# Altium project Bluetooth_Controlled_Led_Matrix_Design.PrjPcb
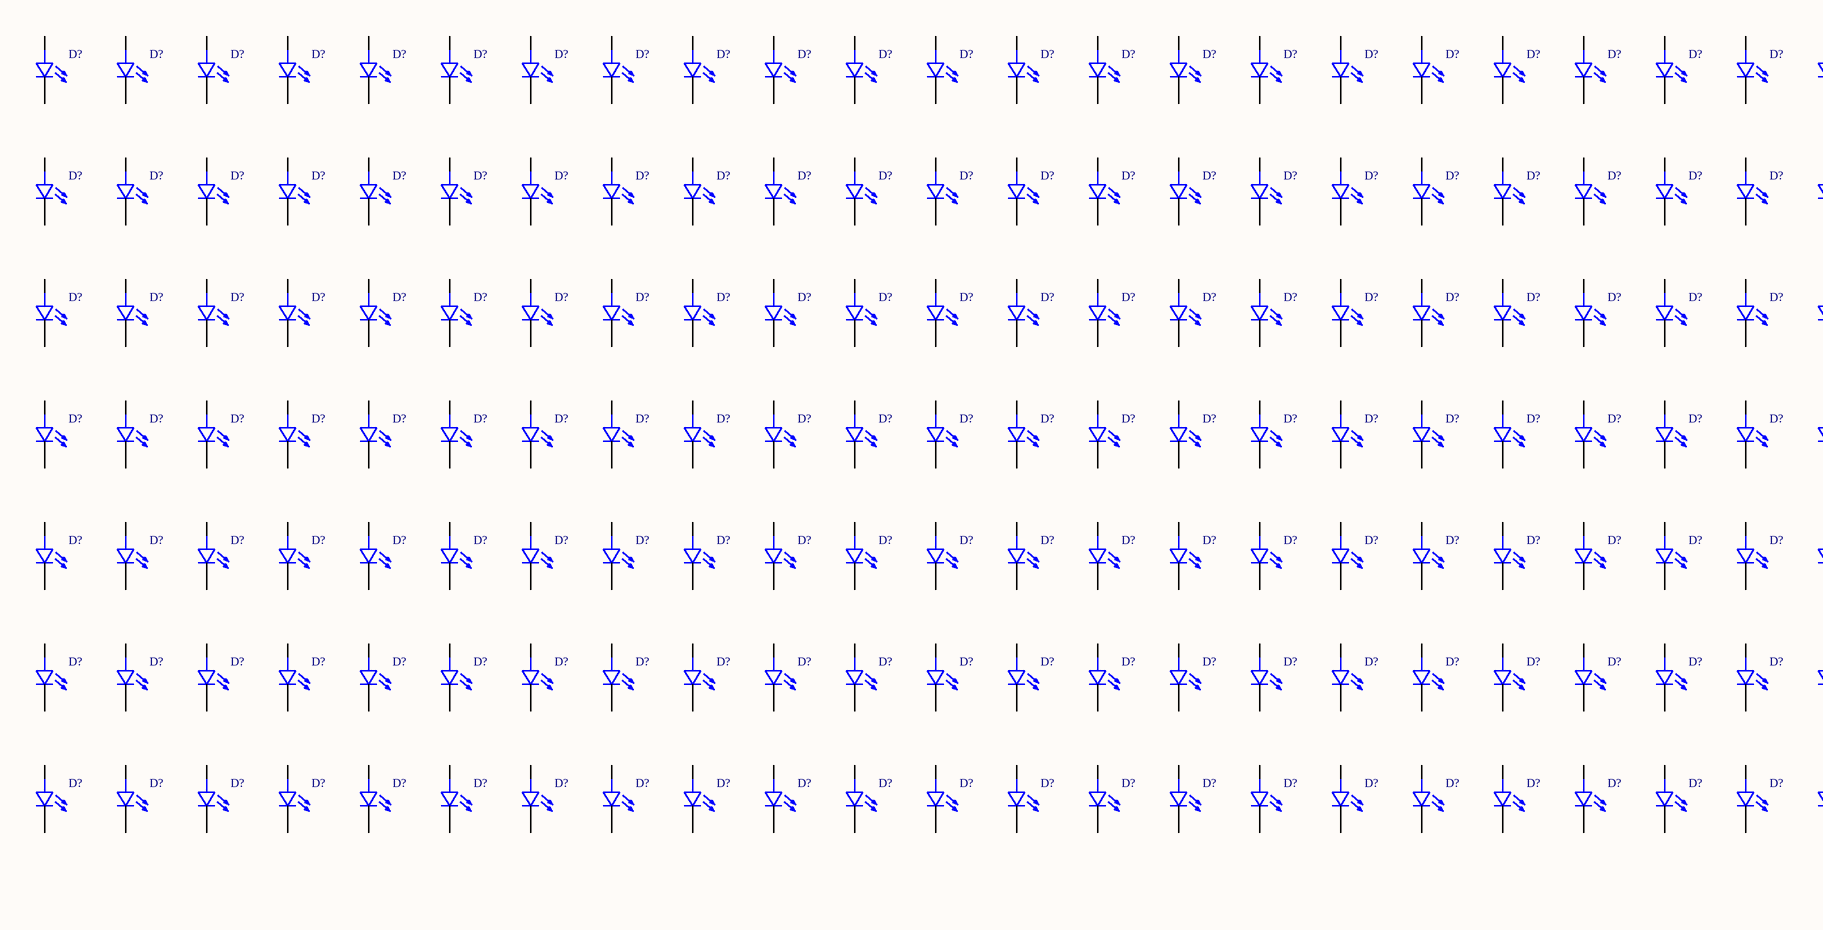
[diagram p0: 7x24_Led_Matrix_Design.SchDoc, left]
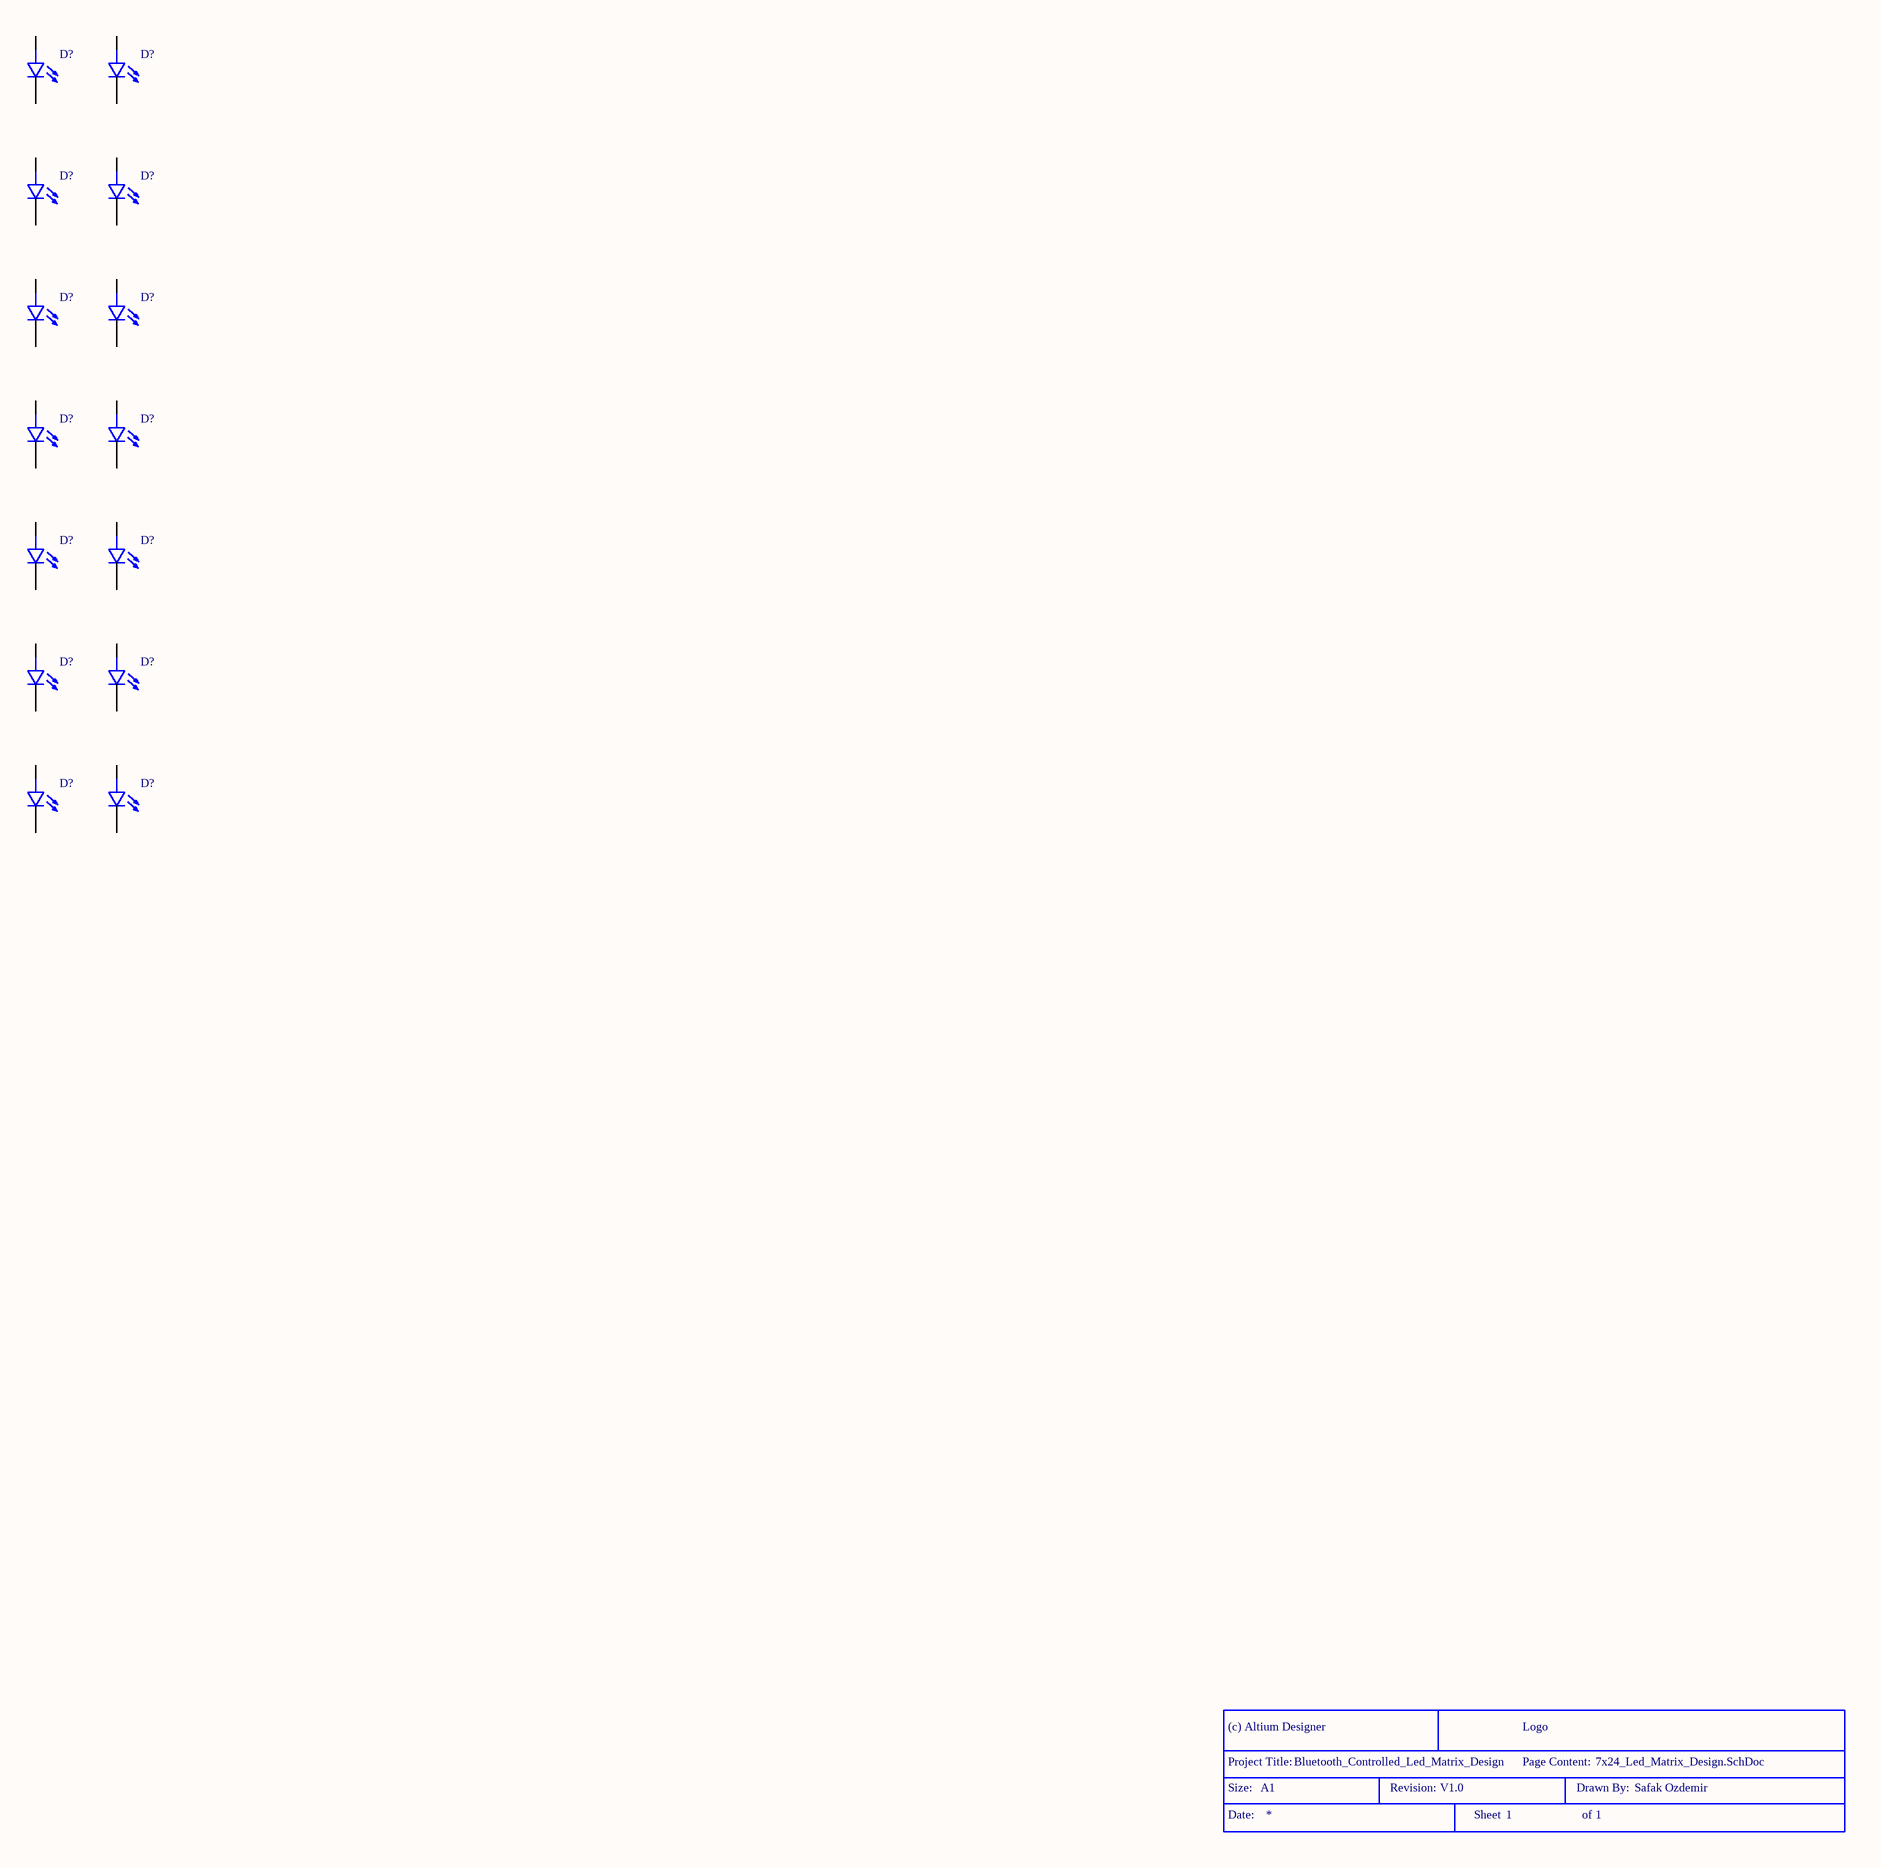
[diagram p1: 7x24_Led_Matrix_Design.SchDoc, right]
NameProject: Bluetooth_Controlled_Led_Matrix_Design
1 sheet, 169 parts. Net scope: global (net labels, ports and power ports of the same name join across sheets).
Board file: Bluetooth_Controlled_Led_Matrix_Design.PcbDoc

## Sheet 7x24_Led_Matrix_Design.SchDoc
size A1; DrawnBy: Safak Ozdemir; Revision: V1.0; SheetNumber: 1; SheetTotal: 1

### Parts
(Parts that share a designator on the sheet are numbered #1, #2 ... from top to bottom, then left to right.)
*  Size: A1  Drawn By: Safak Ozdemir  (hidden comment: Title Block)  (graphical)
D?#1  OF-SMD3528WC  [LED_OF-SMD3528WC]  (value not drawn)
D?#2  OF-SMD3528WC  [LED_OF-SMD3528WC]  (value not drawn)
D?#3  OF-SMD3528WC  [LED_OF-SMD3528WC]  (value not drawn)
D?#4  OF-SMD3528WC  [LED_OF-SMD3528WC]  (value not drawn)
D?#5  OF-SMD3528WC  [LED_OF-SMD3528WC]  (value not drawn)
D?#6  OF-SMD3528WC  [LED_OF-SMD3528WC]  (value not drawn)
D?#7  OF-SMD3528WC  [LED_OF-SMD3528WC]  (value not drawn)
D?#8  OF-SMD3528WC  [LED_OF-SMD3528WC]  (value not drawn)
D?#9  OF-SMD3528WC  [LED_OF-SMD3528WC]  (value not drawn)
D?#10  OF-SMD3528WC  [LED_OF-SMD3528WC]  (value not drawn)
D?#11  OF-SMD3528WC  [LED_OF-SMD3528WC]  (value not drawn)
D?#12  OF-SMD3528WC  [LED_OF-SMD3528WC]  (value not drawn)
D?#13  OF-SMD3528WC  [LED_OF-SMD3528WC]  (value not drawn)
D?#14  OF-SMD3528WC  [LED_OF-SMD3528WC]  (value not drawn)
D?#15  OF-SMD3528WC  [LED_OF-SMD3528WC]  (value not drawn)
D?#16  OF-SMD3528WC  [LED_OF-SMD3528WC]  (value not drawn)
D?#17  OF-SMD3528WC  [LED_OF-SMD3528WC]  (value not drawn)
D?#18  OF-SMD3528WC  [LED_OF-SMD3528WC]  (value not drawn)
D?#19  OF-SMD3528WC  [LED_OF-SMD3528WC]  (value not drawn)
D?#20  OF-SMD3528WC  [LED_OF-SMD3528WC]  (value not drawn)
D?#21  OF-SMD3528WC  [LED_OF-SMD3528WC]  (value not drawn)
D?#22  OF-SMD3528WC  [LED_OF-SMD3528WC]  (value not drawn)
D?#23  OF-SMD3528WC  [LED_OF-SMD3528WC]  (value not drawn)
D?#24  OF-SMD3528WC  [LED_OF-SMD3528WC]  (value not drawn)
D?#25  OF-SMD3528WC  [LED_OF-SMD3528WC]  (value not drawn)
D?#26  OF-SMD3528WC  [LED_OF-SMD3528WC]  (value not drawn)
D?#27  OF-SMD3528WC  [LED_OF-SMD3528WC]  (value not drawn)
D?#28  OF-SMD3528WC  [LED_OF-SMD3528WC]  (value not drawn)
D?#29  OF-SMD3528WC  [LED_OF-SMD3528WC]  (value not drawn)
D?#30  OF-SMD3528WC  [LED_OF-SMD3528WC]  (value not drawn)
D?#31  OF-SMD3528WC  [LED_OF-SMD3528WC]  (value not drawn)
D?#32  OF-SMD3528WC  [LED_OF-SMD3528WC]  (value not drawn)
D?#33  OF-SMD3528WC  [LED_OF-SMD3528WC]  (value not drawn)
D?#34  OF-SMD3528WC  [LED_OF-SMD3528WC]  (value not drawn)
D?#35  OF-SMD3528WC  [LED_OF-SMD3528WC]  (value not drawn)
D?#36  OF-SMD3528WC  [LED_OF-SMD3528WC]  (value not drawn)
D?#37  OF-SMD3528WC  [LED_OF-SMD3528WC]  (value not drawn)
D?#38  OF-SMD3528WC  [LED_OF-SMD3528WC]  (value not drawn)
D?#39  OF-SMD3528WC  [LED_OF-SMD3528WC]  (value not drawn)
D?#40  OF-SMD3528WC  [LED_OF-SMD3528WC]  (value not drawn)
D?#41  OF-SMD3528WC  [LED_OF-SMD3528WC]  (value not drawn)
D?#42  OF-SMD3528WC  [LED_OF-SMD3528WC]  (value not drawn)
D?#43  OF-SMD3528WC  [LED_OF-SMD3528WC]  (value not drawn)
D?#44  OF-SMD3528WC  [LED_OF-SMD3528WC]  (value not drawn)
D?#45  OF-SMD3528WC  [LED_OF-SMD3528WC]  (value not drawn)
D?#46  OF-SMD3528WC  [LED_OF-SMD3528WC]  (value not drawn)
D?#47  OF-SMD3528WC  [LED_OF-SMD3528WC]  (value not drawn)
D?#48  OF-SMD3528WC  [LED_OF-SMD3528WC]  (value not drawn)
D?#49  OF-SMD3528WC  [LED_OF-SMD3528WC]  (value not drawn)
D?#50  OF-SMD3528WC  [LED_OF-SMD3528WC]  (value not drawn)
D?#51  OF-SMD3528WC  [LED_OF-SMD3528WC]  (value not drawn)
D?#52  OF-SMD3528WC  [LED_OF-SMD3528WC]  (value not drawn)
D?#53  OF-SMD3528WC  [LED_OF-SMD3528WC]  (value not drawn)
D?#54  OF-SMD3528WC  [LED_OF-SMD3528WC]  (value not drawn)
D?#55  OF-SMD3528WC  [LED_OF-SMD3528WC]  (value not drawn)
D?#56  OF-SMD3528WC  [LED_OF-SMD3528WC]  (value not drawn)
D?#57  OF-SMD3528WC  [LED_OF-SMD3528WC]  (value not drawn)
D?#58  OF-SMD3528WC  [LED_OF-SMD3528WC]  (value not drawn)
D?#59  OF-SMD3528WC  [LED_OF-SMD3528WC]  (value not drawn)
D?#60  OF-SMD3528WC  [LED_OF-SMD3528WC]  (value not drawn)
D?#61  OF-SMD3528WC  [LED_OF-SMD3528WC]  (value not drawn)
D?#62  OF-SMD3528WC  [LED_OF-SMD3528WC]  (value not drawn)
D?#63  OF-SMD3528WC  [LED_OF-SMD3528WC]  (value not drawn)
D?#64  OF-SMD3528WC  [LED_OF-SMD3528WC]  (value not drawn)
D?#65  OF-SMD3528WC  [LED_OF-SMD3528WC]  (value not drawn)
D?#66  OF-SMD3528WC  [LED_OF-SMD3528WC]  (value not drawn)
D?#67  OF-SMD3528WC  [LED_OF-SMD3528WC]  (value not drawn)
D?#68  OF-SMD3528WC  [LED_OF-SMD3528WC]  (value not drawn)
D?#69  OF-SMD3528WC  [LED_OF-SMD3528WC]  (value not drawn)
D?#70  OF-SMD3528WC  [LED_OF-SMD3528WC]  (value not drawn)
D?#71  OF-SMD3528WC  [LED_OF-SMD3528WC]  (value not drawn)
D?#72  OF-SMD3528WC  [LED_OF-SMD3528WC]  (value not drawn)
D?#73  OF-SMD3528WC  [LED_OF-SMD3528WC]  (value not drawn)
D?#74  OF-SMD3528WC  [LED_OF-SMD3528WC]  (value not drawn)
D?#75  OF-SMD3528WC  [LED_OF-SMD3528WC]  (value not drawn)
D?#76  OF-SMD3528WC  [LED_OF-SMD3528WC]  (value not drawn)
D?#77  OF-SMD3528WC  [LED_OF-SMD3528WC]  (value not drawn)
D?#78  OF-SMD3528WC  [LED_OF-SMD3528WC]  (value not drawn)
D?#79  OF-SMD3528WC  [LED_OF-SMD3528WC]  (value not drawn)
D?#80  OF-SMD3528WC  [LED_OF-SMD3528WC]  (value not drawn)
D?#81  OF-SMD3528WC  [LED_OF-SMD3528WC]  (value not drawn)
D?#82  OF-SMD3528WC  [LED_OF-SMD3528WC]  (value not drawn)
D?#83  OF-SMD3528WC  [LED_OF-SMD3528WC]  (value not drawn)
D?#84  OF-SMD3528WC  [LED_OF-SMD3528WC]  (value not drawn)
D?#85  OF-SMD3528WC  [LED_OF-SMD3528WC]  (value not drawn)
D?#86  OF-SMD3528WC  [LED_OF-SMD3528WC]  (value not drawn)
D?#87  OF-SMD3528WC  [LED_OF-SMD3528WC]  (value not drawn)
D?#88  OF-SMD3528WC  [LED_OF-SMD3528WC]  (value not drawn)
D?#89  OF-SMD3528WC  [LED_OF-SMD3528WC]  (value not drawn)
D?#90  OF-SMD3528WC  [LED_OF-SMD3528WC]  (value not drawn)
D?#91  OF-SMD3528WC  [LED_OF-SMD3528WC]  (value not drawn)
D?#92  OF-SMD3528WC  [LED_OF-SMD3528WC]  (value not drawn)
D?#93  OF-SMD3528WC  [LED_OF-SMD3528WC]  (value not drawn)
D?#94  OF-SMD3528WC  [LED_OF-SMD3528WC]  (value not drawn)
D?#95  OF-SMD3528WC  [LED_OF-SMD3528WC]  (value not drawn)
D?#96  OF-SMD3528WC  [LED_OF-SMD3528WC]  (value not drawn)
D?#97  OF-SMD3528WC  [LED_OF-SMD3528WC]  (value not drawn)
D?#98  OF-SMD3528WC  [LED_OF-SMD3528WC]  (value not drawn)
D?#99  OF-SMD3528WC  [LED_OF-SMD3528WC]  (value not drawn)
D?#100  OF-SMD3528WC  [LED_OF-SMD3528WC]  (value not drawn)
D?#101  OF-SMD3528WC  [LED_OF-SMD3528WC]  (value not drawn)
D?#102  OF-SMD3528WC  [LED_OF-SMD3528WC]  (value not drawn)
D?#103  OF-SMD3528WC  [LED_OF-SMD3528WC]  (value not drawn)
D?#104  OF-SMD3528WC  [LED_OF-SMD3528WC]  (value not drawn)
D?#105  OF-SMD3528WC  [LED_OF-SMD3528WC]  (value not drawn)
D?#106  OF-SMD3528WC  [LED_OF-SMD3528WC]  (value not drawn)
D?#107  OF-SMD3528WC  [LED_OF-SMD3528WC]  (value not drawn)
D?#108  OF-SMD3528WC  [LED_OF-SMD3528WC]  (value not drawn)
D?#109  OF-SMD3528WC  [LED_OF-SMD3528WC]  (value not drawn)
D?#110  OF-SMD3528WC  [LED_OF-SMD3528WC]  (value not drawn)
D?#111  OF-SMD3528WC  [LED_OF-SMD3528WC]  (value not drawn)
D?#112  OF-SMD3528WC  [LED_OF-SMD3528WC]  (value not drawn)
D?#113  OF-SMD3528WC  [LED_OF-SMD3528WC]  (value not drawn)
D?#114  OF-SMD3528WC  [LED_OF-SMD3528WC]  (value not drawn)
D?#115  OF-SMD3528WC  [LED_OF-SMD3528WC]  (value not drawn)
D?#116  OF-SMD3528WC  [LED_OF-SMD3528WC]  (value not drawn)
D?#117  OF-SMD3528WC  [LED_OF-SMD3528WC]  (value not drawn)
D?#118  OF-SMD3528WC  [LED_OF-SMD3528WC]  (value not drawn)
D?#119  OF-SMD3528WC  [LED_OF-SMD3528WC]  (value not drawn)
D?#120  OF-SMD3528WC  [LED_OF-SMD3528WC]  (value not drawn)
D?#121  OF-SMD3528WC  [LED_OF-SMD3528WC]  (value not drawn)
D?#122  OF-SMD3528WC  [LED_OF-SMD3528WC]  (value not drawn)
D?#123  OF-SMD3528WC  [LED_OF-SMD3528WC]  (value not drawn)
D?#124  OF-SMD3528WC  [LED_OF-SMD3528WC]  (value not drawn)
D?#125  OF-SMD3528WC  [LED_OF-SMD3528WC]  (value not drawn)
D?#126  OF-SMD3528WC  [LED_OF-SMD3528WC]  (value not drawn)
D?#127  OF-SMD3528WC  [LED_OF-SMD3528WC]  (value not drawn)
D?#128  OF-SMD3528WC  [LED_OF-SMD3528WC]  (value not drawn)
D?#129  OF-SMD3528WC  [LED_OF-SMD3528WC]  (value not drawn)
D?#130  OF-SMD3528WC  [LED_OF-SMD3528WC]  (value not drawn)
D?#131  OF-SMD3528WC  [LED_OF-SMD3528WC]  (value not drawn)
D?#132  OF-SMD3528WC  [LED_OF-SMD3528WC]  (value not drawn)
D?#133  OF-SMD3528WC  [LED_OF-SMD3528WC]  (value not drawn)
D?#134  OF-SMD3528WC  [LED_OF-SMD3528WC]  (value not drawn)
D?#135  OF-SMD3528WC  [LED_OF-SMD3528WC]  (value not drawn)
D?#136  OF-SMD3528WC  [LED_OF-SMD3528WC]  (value not drawn)
D?#137  OF-SMD3528WC  [LED_OF-SMD3528WC]  (value not drawn)
D?#138  OF-SMD3528WC  [LED_OF-SMD3528WC]  (value not drawn)
D?#139  OF-SMD3528WC  [LED_OF-SMD3528WC]  (value not drawn)
D?#140  OF-SMD3528WC  [LED_OF-SMD3528WC]  (value not drawn)
D?#141  OF-SMD3528WC  [LED_OF-SMD3528WC]  (value not drawn)
D?#142  OF-SMD3528WC  [LED_OF-SMD3528WC]  (value not drawn)
D?#143  OF-SMD3528WC  [LED_OF-SMD3528WC]  (value not drawn)
D?#144  OF-SMD3528WC  [LED_OF-SMD3528WC]  (value not drawn)
D?#145  OF-SMD3528WC  [LED_OF-SMD3528WC]  (value not drawn)
D?#146  OF-SMD3528WC  [LED_OF-SMD3528WC]  (value not drawn)
D?#147  OF-SMD3528WC  [LED_OF-SMD3528WC]  (value not drawn)
D?#148  OF-SMD3528WC  [LED_OF-SMD3528WC]  (value not drawn)
D?#149  OF-SMD3528WC  [LED_OF-SMD3528WC]  (value not drawn)
D?#150  OF-SMD3528WC  [LED_OF-SMD3528WC]  (value not drawn)
D?#151  OF-SMD3528WC  [LED_OF-SMD3528WC]  (value not drawn)
D?#152  OF-SMD3528WC  [LED_OF-SMD3528WC]  (value not drawn)
D?#153  OF-SMD3528WC  [LED_OF-SMD3528WC]  (value not drawn)
D?#154  OF-SMD3528WC  [LED_OF-SMD3528WC]  (value not drawn)
D?#155  OF-SMD3528WC  [LED_OF-SMD3528WC]  (value not drawn)
D?#156  OF-SMD3528WC  [LED_OF-SMD3528WC]  (value not drawn)
D?#157  OF-SMD3528WC  [LED_OF-SMD3528WC]  (value not drawn)
D?#158  OF-SMD3528WC  [LED_OF-SMD3528WC]  (value not drawn)
D?#159  OF-SMD3528WC  [LED_OF-SMD3528WC]  (value not drawn)
D?#160  OF-SMD3528WC  [LED_OF-SMD3528WC]  (value not drawn)
D?#161  OF-SMD3528WC  [LED_OF-SMD3528WC]  (value not drawn)
D?#162  OF-SMD3528WC  [LED_OF-SMD3528WC]  (value not drawn)
D?#163  OF-SMD3528WC  [LED_OF-SMD3528WC]  (value not drawn)
D?#164  OF-SMD3528WC  [LED_OF-SMD3528WC]  (value not drawn)
D?#165  OF-SMD3528WC  [LED_OF-SMD3528WC]  (value not drawn)
D?#166  OF-SMD3528WC  [LED_OF-SMD3528WC]  (value not drawn)
D?#167  OF-SMD3528WC  [LED_OF-SMD3528WC]  (value not drawn)
D?#168  OF-SMD3528WC  [LED_OF-SMD3528WC]  (value not drawn)

### Nets

Not connected (* = marked no-connect by the designer): D?#1 1(A) 2(C); D?#2 1(A) 2(C); D?#3 1(A) 2(C); D?#4 1(A) 2(C); D?#5 1(A) 2(C); D?#6 1(A) 2(C); D?#7 1(A) 2(C); D?#8 1(A) 2(C); D?#9 1(A) 2(C); D?#10 1(A) 2(C); D?#11 1(A) 2(C); D?#12 1(A) 2(C); D?#13 1(A) 2(C); D?#14 1(A) 2(C); D?#15 1(A) 2(C); D?#16 1(A) 2(C); D?#17 1(A) 2(C); D?#18 1(A) 2(C); D?#19 1(A) 2(C); D?#20 1(A) 2(C); D?#21 1(A) 2(C); D?#22 1(A) 2(C); D?#23 1(A) 2(C); D?#24 1(A) 2(C); D?#25 1(A) 2(C); D?#26 1(A) 2(C); D?#27 1(A) 2(C); D?#28 1(A) 2(C); D?#29 1(A) 2(C); D?#30 1(A) 2(C); D?#31 1(A) 2(C); D?#32 1(A) 2(C); D?#33 1(A) 2(C); D?#34 1(A) 2(C); D?#35 1(A) 2(C); D?#36 1(A) 2(C); D?#37 1(A) 2(C); D?#38 1(A) 2(C); D?#39 1(A) 2(C); D?#40 1(A) 2(C); D?#41 1(A) 2(C); D?#42 1(A) 2(C); D?#43 1(A) 2(C); D?#44 1(A) 2(C); D?#45 1(A) 2(C); D?#46 1(A) 2(C); D?#47 1(A) 2(C); D?#48 1(A) 2(C); D?#49 1(A) 2(C); D?#50 1(A) 2(C); D?#51 1(A) 2(C); D?#52 1(A) 2(C); D?#53 1(A) 2(C); D?#54 1(A) 2(C); D?#55 1(A) 2(C); D?#56 1(A) 2(C); D?#57 1(A) 2(C); D?#58 1(A) 2(C); D?#59 1(A) 2(C); D?#60 1(A) 2(C); D?#61 1(A) 2(C); D?#62 1(A) 2(C); D?#63 1(A) 2(C); D?#64 1(A) 2(C); D?#65 1(A) 2(C); D?#66 1(A) 2(C); D?#67 1(A) 2(C); D?#68 1(A) 2(C); D?#69 1(A) 2(C); D?#70 1(A) 2(C); D?#71 1(A) 2(C); D?#72 1(A) 2(C); D?#73 1(A) 2(C); D?#74 1(A) 2(C); D?#75 1(A) 2(C); D?#76 1(A) 2(C); D?#77 1(A) 2(C); D?#78 1(A) 2(C); D?#79 1(A) 2(C); D?#80 1(A) 2(C); D?#81 1(A) 2(C); D?#82 1(A) 2(C); D?#83 1(A) 2(C); D?#84 1(A) 2(C); D?#85 1(A) 2(C); D?#86 1(A) 2(C); D?#87 1(A) 2(C); D?#88 1(A) 2(C); D?#89 1(A) 2(C); D?#90 1(A) 2(C); D?#91 1(A) 2(C); D?#92 1(A) 2(C); D?#93 1(A) 2(C); D?#94 1(A) 2(C); D?#95 1(A) 2(C); D?#96 1(A) 2(C); D?#97 1(A) 2(C); D?#98 1(A) 2(C); D?#99 1(A) 2(C); D?#100 1(A) 2(C); D?#101 1(A) 2(C); D?#102 1(A) 2(C); D?#103 1(A) 2(C); D?#104 1(A) 2(C); D?#105 1(A) 2(C); D?#106 1(A) 2(C); D?#107 1(A) 2(C); D?#108 1(A) 2(C); D?#109 1(A) 2(C); D?#110 1(A) 2(C); D?#111 1(A) 2(C); D?#112 1(A) 2(C); D?#113 1(A) 2(C); D?#114 1(A) 2(C); D?#115 1(A) 2(C); D?#116 1(A) 2(C); D?#117 1(A) 2(C); D?#118 1(A) 2(C); D?#119 1(A) 2(C); D?#120 1(A) 2(C); D?#121 1(A) 2(C); D?#122 1(A) 2(C); D?#123 1(A) 2(C); D?#124 1(A) 2(C); D?#125 1(A) 2(C); D?#126 1(A) 2(C); D?#127 1(A) 2(C); D?#128 1(A) 2(C); D?#129 1(A) 2(C); D?#130 1(A) 2(C); D?#131 1(A) 2(C); D?#132 1(A) 2(C); D?#133 1(A) 2(C); D?#134 1(A) 2(C); D?#135 1(A) 2(C); D?#136 1(A) 2(C); D?#137 1(A) 2(C); D?#138 1(A) 2(C); D?#139 1(A) 2(C); D?#140 1(A) 2(C); D?#141 1(A) 2(C); D?#142 1(A) 2(C); D?#143 1(A) 2(C); D?#144 1(A) 2(C); D?#145 1(A) 2(C); D?#146 1(A) 2(C); D?#147 1(A) 2(C); D?#148 1(A) 2(C); D?#149 1(A) 2(C); D?#150 1(A) 2(C); D?#151 1(A) 2(C); D?#152 1(A) 2(C); D?#153 1(A) 2(C); D?#154 1(A) 2(C); D?#155 1(A) 2(C); D?#156 1(A) 2(C); D?#157 1(A) 2(C); D?#158 1(A) 2(C); D?#159 1(A) 2(C); D?#160 1(A) 2(C); D?#161 1(A) 2(C); D?#162 1(A) 2(C); D?#163 1(A) 2(C); D?#164 1(A) 2(C); D?#165 1(A) 2(C); D?#166 1(A) 2(C); D?#167 1(A) 2(C); D?#168 1(A) 2(C)

### Notes on the sheet
- (in symbol Title Block) (c) Altium Designer; Logo; Project Title:; Page Content:; Size:; Revision:; Drawn By:; Date:; Sheet; of

### Library data of the parts
D?#1-D?#168 = OF-SMD3528WC: LED; SMD; 3528, PLCC2; white cold; 1700-2500mcd; 120Â°; 2; MF: Optoflash; Availability: Not in stock; SnapEDA_Link: https://www.snapeda.com/parts/OF-SMD3528WC/Optoflash/view-part/?ref=snap; MP: OF-SMD3528WC; Value: *; Price: None; Package: PLCC-2 Optoflash; Check_prices: https://www.snapeda.com/parts/OF-SMD3528WC/Optoflash/view-part/?ref=eda